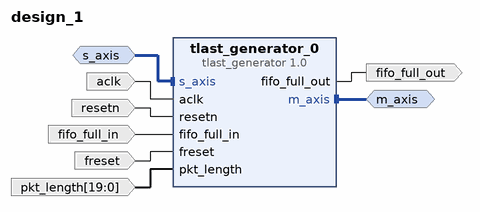
[diagram p0: block diagram of the top level]
# Vivado block design design_1, xc7z020clg400-1, Vivado 2018.3
create_bd_design design_1

create_bd_intf_port -mode Master -vlnv xilinx.com:interface:axis_rtl:1.0 m_axis
create_bd_intf_port -mode Slave -vlnv xilinx.com:interface:axis_rtl:1.0 s_axis
set_property -dict [list \
  CONFIG.HAS_TKEEP 0 \
  CONFIG.HAS_TLAST 0 \
  CONFIG.HAS_TREADY 1 \
  CONFIG.HAS_TSTRB 0 \
  CONFIG.LAYERED_METADATA undef \
  CONFIG.TDATA_NUM_BYTES 2 \
  CONFIG.TDEST_WIDTH 0 \
  CONFIG.TID_WIDTH 0 \
  CONFIG.TUSER_WIDTH 0 \
] [get_bd_intf_ports s_axis]
create_bd_port -dir O fifo_full_out
create_bd_port -dir I -type clk aclk
set_property -dict {CONFIG.FREQ_HZ 100000000} [get_bd_ports aclk]
create_bd_port -dir I -type rst resetn
create_bd_port -dir I fifo_full_in
create_bd_port -dir I freset
create_bd_port -dir I -from 19 -to 0 pkt_length

create_bd_cell -type ip -vlnv xilinx.com:user:tlast_generator:1.0 tlast_generator_0
set_property -dict {CONFIG.MAX_PKT_LENGTH 65536} [get_bd_cells tlast_generator_0]

# ---- connections ----

connect_bd_intf_net [get_bd_intf_ports s_axis] [get_bd_intf_pins tlast_generator_0/s_axis]
connect_bd_intf_net [get_bd_intf_ports m_axis] [get_bd_intf_pins tlast_generator_0/m_axis]
connect_bd_net [get_bd_pins tlast_generator_0/fifo_full_out] [get_bd_ports fifo_full_out]
connect_bd_net [get_bd_ports aclk] [get_bd_pins tlast_generator_0/aclk]
connect_bd_net [get_bd_ports resetn] [get_bd_pins tlast_generator_0/resetn]
connect_bd_net [get_bd_ports fifo_full_in] [get_bd_pins tlast_generator_0/fifo_full_in]
connect_bd_net [get_bd_ports freset] [get_bd_pins tlast_generator_0/freset]
connect_bd_net [get_bd_ports pkt_length] [get_bd_pins tlast_generator_0/pkt_length]

validate_bd_design
save_bd_design
